# Altium project Tracker.PrjPcb
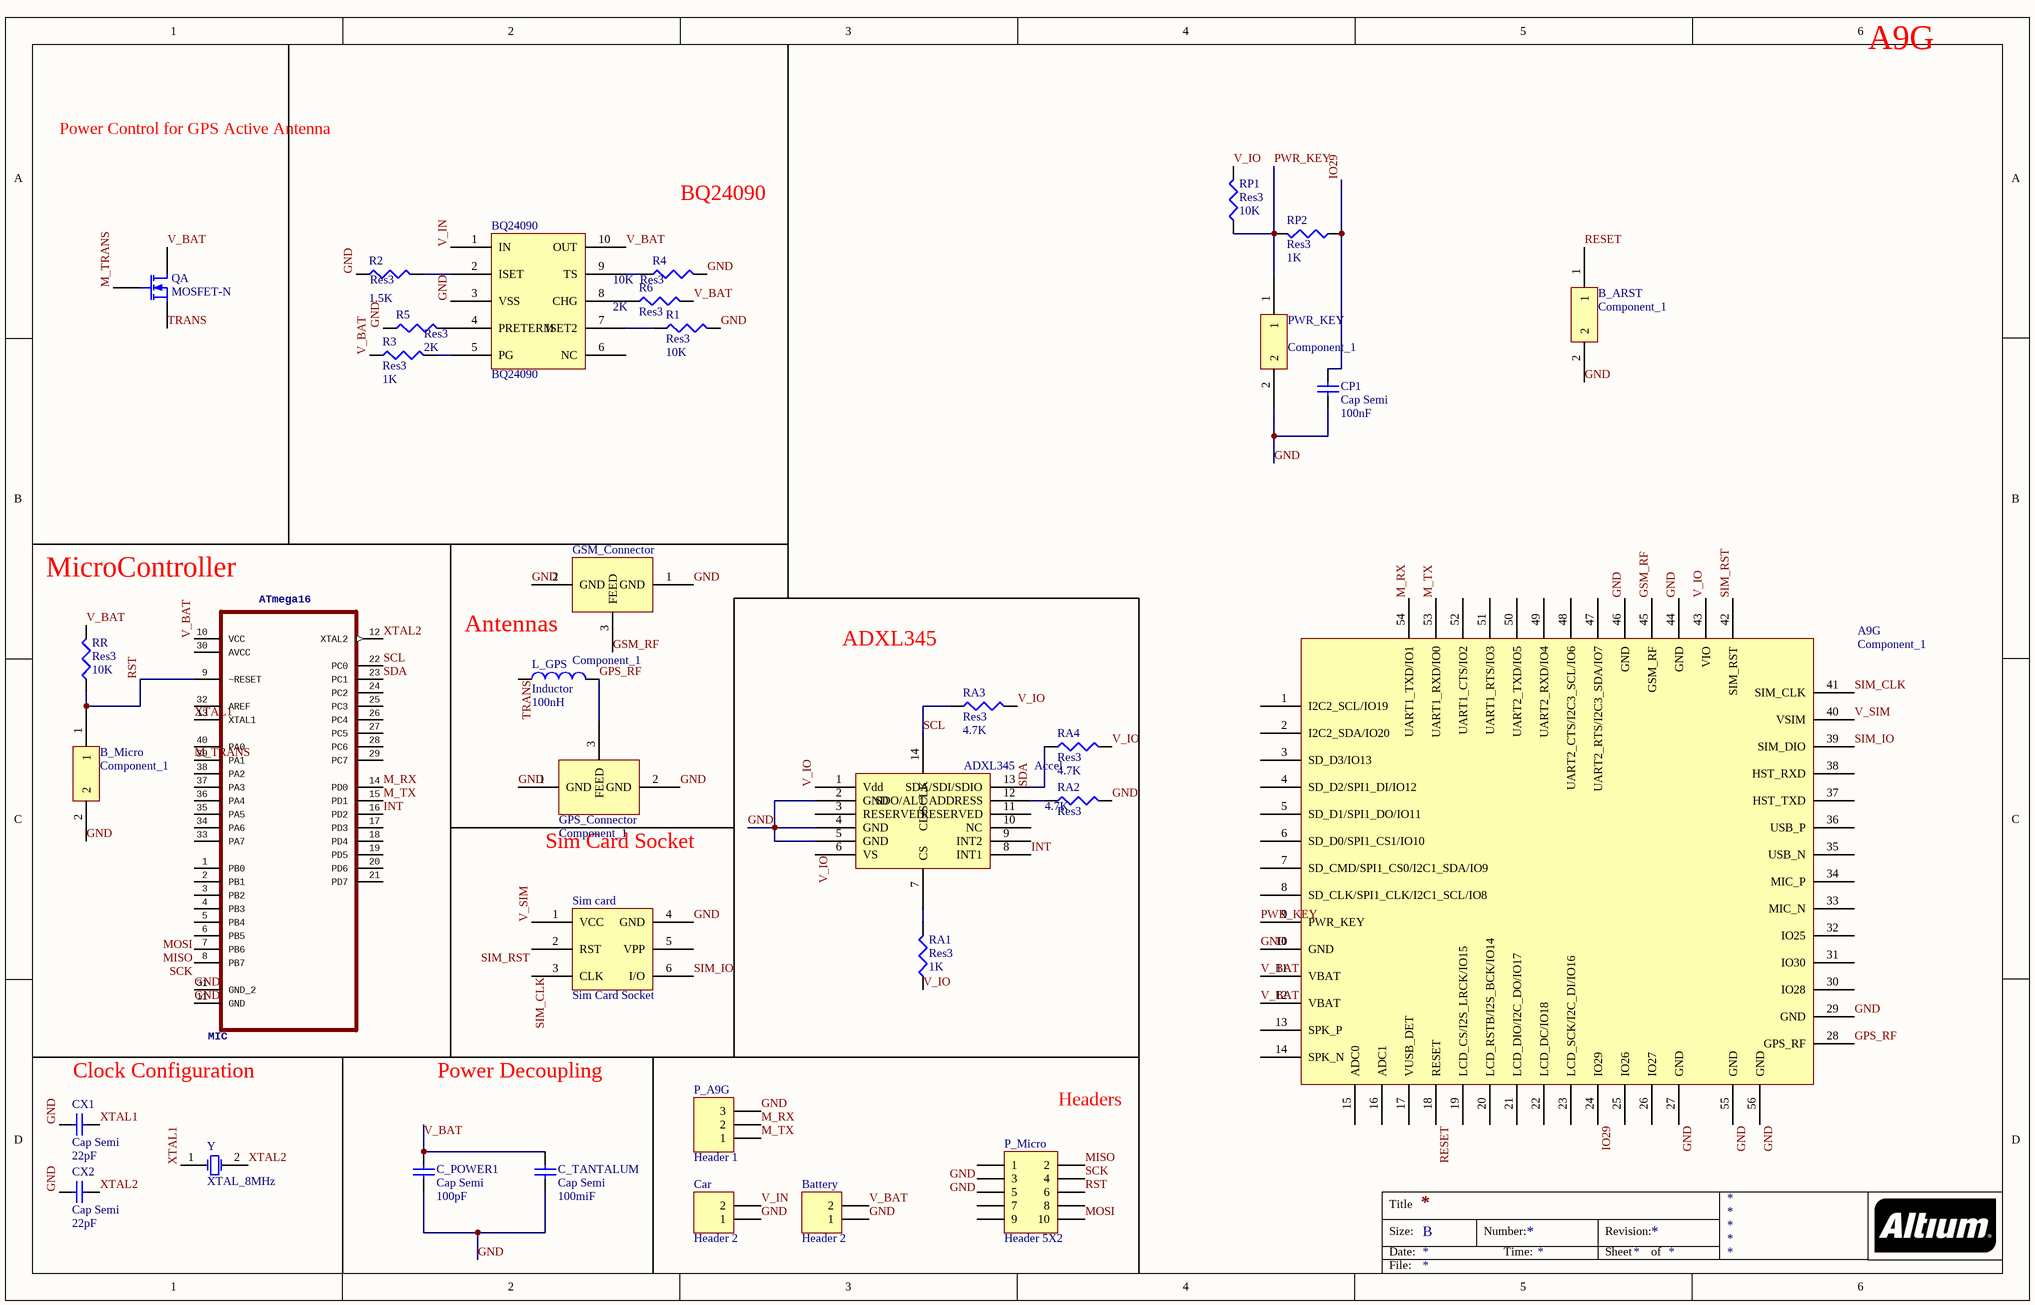
[diagram p0: Sheet1.SchDoc]
1 sheet, 35 parts. Net scope: global (net labels, ports and power ports of the same name join across sheets).
Board file: PCB1.PcbDoc

## Sheet Sheet1.SchDoc
size B

### Parts
A9G  Component_1  [PCBComponent_1]
Accel  ADXL345  [PCBComponent_1]
ATmega16  MIC  [DIP254P1524X482-40]
B_ARST  Component_1  [PCBComponent_1]
B_Micro  Component_1  [PCBComponent_1]
Battery  Header 2  [HDR1X2]
BQ24090  BQ24090  [PCBComponent_1]
C_POWER1  Cap Semi  value 100pF  [1608[0603]]
C_TANTALUM  Cap Semi  value 100miF  [C1206]
Car  Header 2  [HDR1X2]
CP1  Cap Semi  value 100nF  [1608[0603]]
CX1  Cap Semi  value 22pF  [1608[0603]]
CX2  Cap Semi  value 22pF  [1608[0603]]
GPS_Connector  Component_1  [PCBComponent_1]
GSM_Connector  Component_1  [PCBComponent_1]
L_GPS  Inductor  value 100nH  [0603]
P_A9G  Header 1  [HDR1X3]
P_Micro  Header 5X2  [HDR2X5]
PWR_KEY  Component_1  [PCBComponent_1]
QA  MOSFET-N  [E3]
R1  Res3  value 10K  [J1-0603]
R2  Res3  value 1.5K  [J1-0603]
R3  Res3  value 1K  [J1-0603]
R4  Res3  value 10K  [J1-0603]
R5  Res3  value 2K  [J1-0603]
R6  Res3  value 2K  [J1-0603]
RA1  Res3  value 1K  [J1-0603]
RA2  Res3  value 4.7K  [J1-0603]
RA3  Res3  value 4.7K  [J1-0603]
RA4  Res3  value 4.7K  [J1-0603]
RP1  Res3  value 10K  [J1-0603]
RP2  Res3  value 1K  [J1-0603]
RR  Res3  value 10K  [J1-0603]
Sim_card  Sim Card Socket  [PCBComponent_1]
Y  XTAL_8MHz  [R38]

### Nets
GND: A9G.10(GND) A9G.27(GND) A9G.29(GND) A9G.44(GND) A9G.46(GND) A9G.55(GND) A9G.56(GND) Accel.2(GND) Accel.4(GND) Accel.5(GND) ATmega16.11(GND) ATmega16.31(GND_2) B_ARST.2 B_Micro.2 Battery.1 BQ24090.3(VSS) C_POWER1.1 C_TANTALUM.1 Car.1 CP1.1 CX1.1 CX2.1 GPS_Connector.1(GND) GPS_Connector.2(GND) GSM_Connector.1(GND) GSM_Connector.2(GND) P_A9G.3 P_Micro.1 P_Micro.3 PWR_KEY.2 R1.2 R2.1 R4.2 R5.1 RA2.2 Sim_card.4(GND)
GPS_RF: A9G.28(GPS_RF) GPS_Connector.3(FEED) L_GPS.2
GSM_RF: A9G.45(GSM_RF) GSM_Connector.3(FEED)
INT: Accel.8(INT1) ATmega16.16(PD2)
IO29: A9G.24(IO29) CP1.2 RP2.1
M_RX: A9G.54(UART1_TXD/IO1) ATmega16.14(PD0) P_A9G.2
M_TRANS: ATmega16.39(PA1) QA.2(G)
M_TX: A9G.53(UART1_RXD/IO0) ATmega16.15(PD1) P_A9G.1
MISO: ATmega16.7(PB6) P_Micro.2
MOSI: ATmega16.6(PB5) P_Micro.10
PWR_KEY: A9G.9(PWR_KEY) PWR_KEY.1 RP1.1 RP2.2
RESET: A9G.18(RESET) B_ARST.1
RST: ATmega16.9(~RESET) B_Micro.1 P_Micro.6 RR.1
SCK: ATmega16.8(PB7) P_Micro.4
SCL: Accel.14(CL/SCLK) ATmega16.22(PC0) RA3.1
SDA: Accel.13(SDA/SDI/SDIO) ATmega16.23(PC1) RA4.1
SIM_CLK: A9G.41(SIM_CLK) Sim_card.3(CLK)
SIM_IO: A9G.39(SIM_DIO) Sim_card.6(I/O)
SIM_RST: A9G.42(SIM_RST) Sim_card.2(RST)
TRANS: L_GPS.1 QA.3(S)
V_BAT: A9G.11(VBAT) A9G.12(VBAT) ATmega16.10(VCC) Battery.2 BQ24090.10(OUT) C_POWER1.2 C_TANTALUM.2 QA.1(D) R3.1 R6.2 RR.2
V_IN: BQ24090.1(IN) Car.2
V_IO: A9G.43(VIO) Accel.1(Vdd) Accel.6(VS) RA1.1 RA3.2 RA4.2 RP1.2
V_SIM: A9G.40(VSIM) Sim_card.1(VCC)
XTAL1: ATmega16.13(XTAL1) CX1.2 Y.1(OSC1)
XTAL2: ATmega16.12(XTAL2) CX2.2 Y.2(OSC2)
NetAccel_7: Accel.7(CS) RA1.2
NetAccel_12: Accel.12(SDO/ALT_ADDRESS) RA2.1
NetBQ24090_2: BQ24090.2(ISET) R2.2
NetBQ24090_4: BQ24090.4(PRETERM) R5.2
NetBQ24090_5: BQ24090.5(PG) R3.2
NetBQ24090_7: BQ24090.7(ISET2) R1.1
NetBQ24090_8: BQ24090.8(CHG) R6.1
NetBQ24090_9: BQ24090.9(TS) R4.1

Not connected (* = marked no-connect by the designer): A9G 1(I2C2_SCL/IO19) 2(I2C2_SDA/IO20) 3(SD_D3/IO13) 4(SD_D2/SPI1_DI/IO12) 5(SD_D1/SPI1_DO/IO11) 6(SD_D0/SPI1_CS1/IO10) 7(SD_CMD/SPI1_CS0/I2C1_SDA/IO9) 8(SD_CLK/SPI1_CLK/I2C1_SCL/IO8) 13(SPK_P) 14(SPK_N) 15(ADC0) 16(ADC1) 17(VUSB_DET) 19(LCD_CS/I2S_LRCK/IO15) 20(LCD_RSTB/I2S_BCK/IO14) 21(LCD_DIO/I2C_DO/IO17) 22(LCD_DC/IO18) 23(LCD_SCK/I2C_DI/IO16) 25(IO26) 26(IO27) 30(IO28) 31(IO30) 32(IO25) 33(MIC_N) 34(MIC_P) 35(USB_N) 36(USB_P) 37(HST_TXD) 38(HST_RXD) 47(UART2_RTS/I2C3_SDA/IO7) 48(UART2_CTS/I2C3_SCL/IO6) 49(UART2_RXD/IO4) 50(UART2_TXD/IO5) 51(UART1_RTS/IO3) 52(UART1_CTS/IO2); Accel 3(RESERVED) 9(INT2) 10(NC) 11(RESERVED); ATmega16 1(PB0) 2(PB1) 3(PB2) 4(PB3) 5(PB4) 17(PD3) 18(PD4) 19(PD5) 20(PD6) 21(PD7) 24(PC2) 25(PC3) 26(PC4) 27(PC5) 28(PC6) 29(PC7) 30(AVCC) 32(AREF) 33(PA7) 34(PA6) 35(PA5) 36(PA4) 37(PA3) 38(PA2) 40(PA0); BQ24090 6(NC); P_Micro 5 7 8 9; Sim_card 5(VPP)

### Notes on the sheet
- A9G
- Power Control for GPS Active Antenna
- BQ24090
- MicroController
- (near GSM_Connector) Antennas
- ADXL345
- Sim Card Socket
- Clock Configuration
- Power Decoupling
- Headers
- Title
- Size:
- Date:
- B
- Number:
- Time:
- Revision:
- Sheet
- of
- File:

### Library data of the parts
Accel BQ24090 Sim_card = Component_1
ATmega16 = ATMEGA16A-PU: MF: Microchip; MP: ATMEGA16A-PU; Price: None; Availability: Warning; Mouser-Purchase-URL: https://snapeda.com/shop?store=Mouser&id=618034; Package: PDIP-40 Microchip
Battery Car = Header 2: Header, 2-Pin; LatestRevisionDate: 17-Jul-2002; LatestRevisionNote: Re-released for DXP Platform.; Publisher: Altium Limited
C_POWER1 C_TANTALUM CP1 CX1 CX2 = Cap Semi: Capacitor (Semiconductor SIM Model); Published: 8-Jun-2000; LatestRevisionDate: 29-May-2009; LatestRevisionNote: IPC-7351 Footprint Added.; PackageReference: C1206; Publisher: Altium Limited; PackageDescription: Chip Capacitor
L_GPS = Inductor: Code_IEC: 1005; Published: 8-Jun-2000; LatestRevisionDate: 29-May-2009; LatestRevisionNote: IPC-7351 Footprint Added.; PackageReference: 0402-A; Publisher: Altium Limited; PackageDescription: Chip Inductor; Code_JEITA: 0402
P_A9G = Header 3: Header, 3-Pin; LatestRevisionDate: 17-Jul-2002; LatestRevisionNote: Re-released for DXP Platform.; Publisher: Altium Limited
P_Micro = Header 5X2: Header, 5-Pin, Dual row; LatestRevisionDate: 17-Jul-2002; LatestRevisionNote: Re-released for DXP Platform.; Publisher: Altium Limited
QA = MOSFET-N: N-Channel MOSFET; Published: 8-Jun-2000; LatestRevisionDate: 17-Jul-2002; LatestRevisionNote: Re-released for DXP Platform.; PackageVersion: 1995/1996; PackageReference: E3; Publisher: Altium Limited; PackageDescription: TO, Flat Index; 3 In-Line, Axial Leads; Body Dia. 4.6mm; Lead Dia. 0.5 mm (max)
R1-R6 RA1-RA4 RP1 RP2 RR = Res3: Resistor; Published: 8-Jun-2000; LatestRevisionDate: 29-May-2009; LatestRevisionNote: IPC-7351 Footprint Added.; PackageReference: J1-0603; Publisher: Altium Limited; PackageDescription: Chip Resistor
Y = XTAL: Crystal Oscillator; Published: 8-Jun-2000; LatestRevisionDate: 17-Jul-2002; LatestRevisionNote: Re-released for DXP Platform.; PackageReference: R38; Publisher: Altium Limited; PackageDescription: Crystal, Thru-Hole; 2 Leads; Body 3.1 x 8.2 mm (Dia.xH)